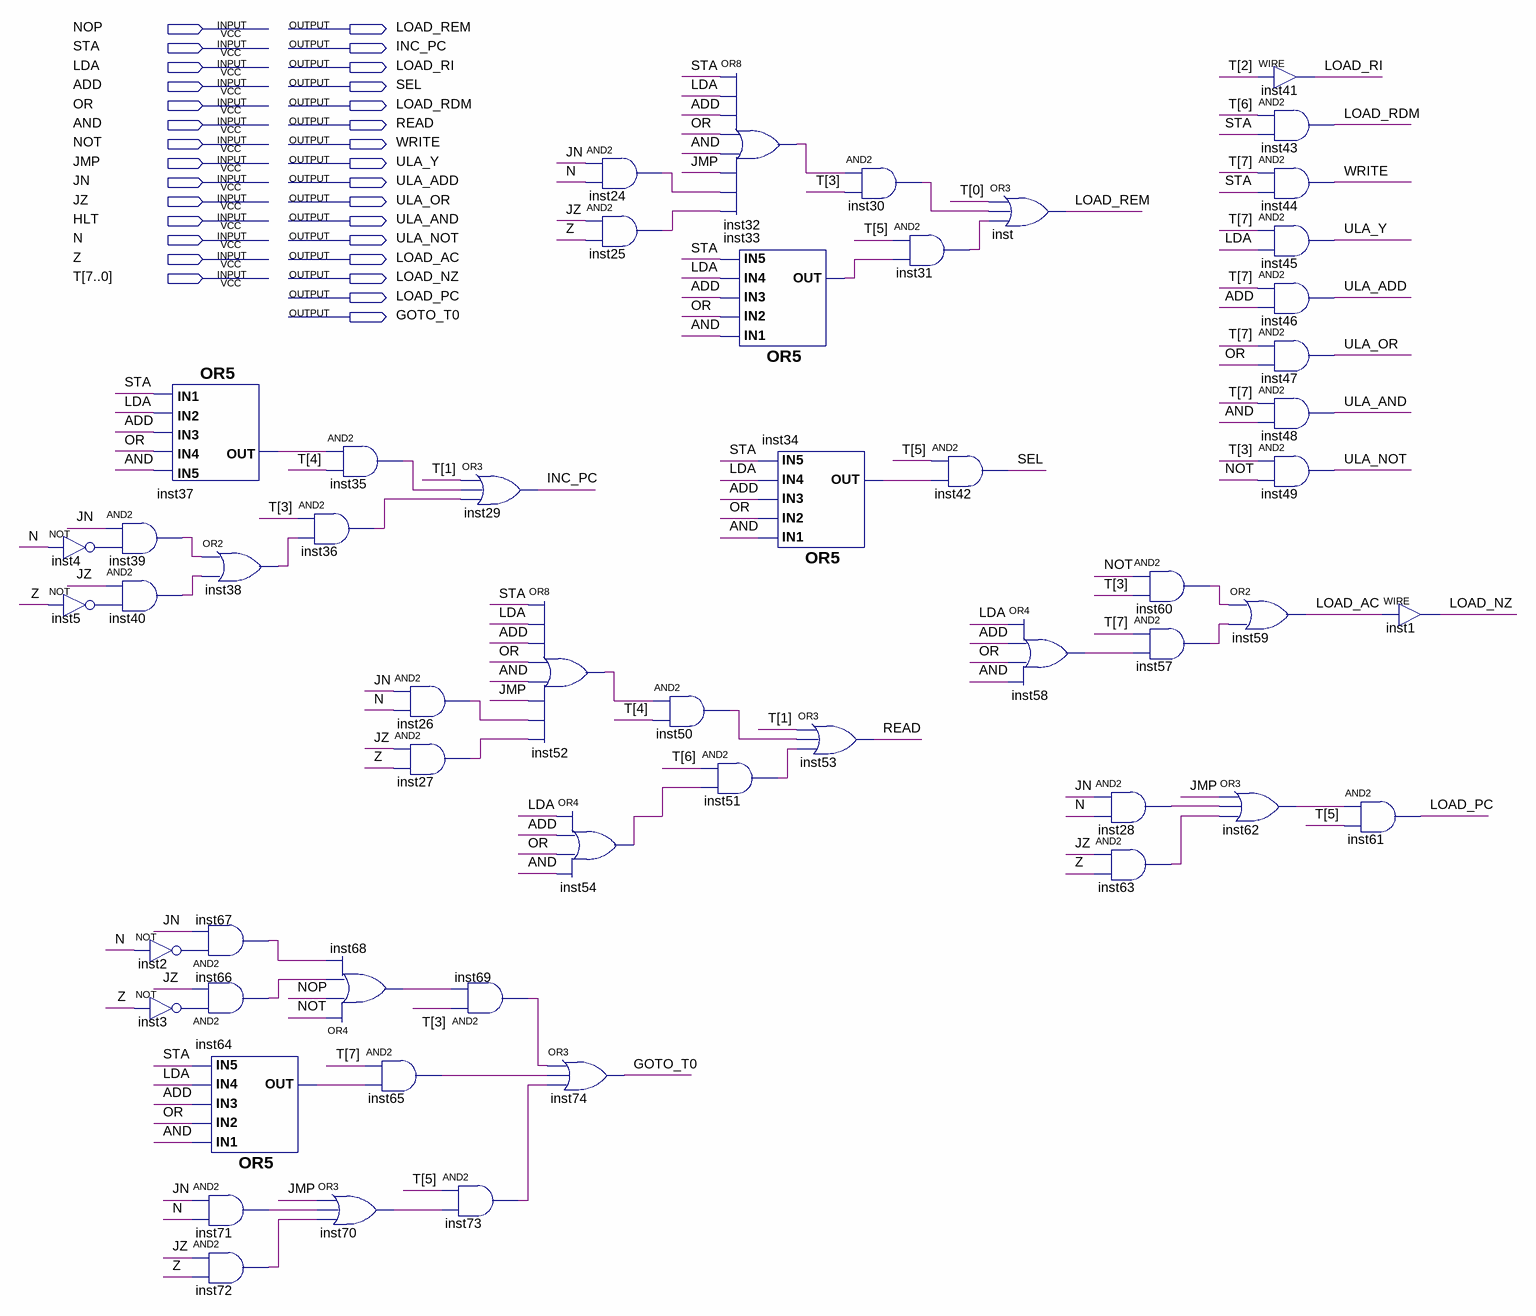
[diagram p0: schematic sheet]
// Quartus schematic CONTROL_UNIT.bdf as structural Verilog: 55 symbols, 30 pins
module CONTROL_UNIT (
  input  NOP,
  input  STA,
  input  LDA,
  input  ADD,
  input  OR,
  input  AND,
  input  NOT,
  input  JMP,
  input  JN,
  input  JZ,
  input  HLT,
  input  N,
  input  Z,
  input  [7:0] T,
  output LOAD_REM,
  output INC_PC,
  output LOAD_RI,
  output SEL,
  output LOAD_RDM,
  output READ,
  output WRITE,
  output ULA_Y,
  output ULA_ADD,
  output ULA_OR,
  output ULA_AND,
  output ULA_NOT,
  output LOAD_AC,
  output LOAD_NZ,
  output LOAD_PC,
  output GOTO_T0
);

  wire inst2_out, inst3_out, inst4_out, inst5_out, inst24_out, inst25_out, inst26_out, inst27_out,
       inst28_out, inst30_out, inst31_out, inst32_out, inst33_out, inst34_out, inst35_out, inst36_out,
       inst37_out, inst38_out, inst39_out, inst40_out, inst50_out, inst51_out, inst52_out, inst54_out,
       inst57_out, inst58_out, inst60_out, inst62_out, inst63_out, inst64_out, inst65_out, inst66_out,
       inst67_out, inst68_out, inst69_out, inst70_out, inst71_out, inst72_out, inst73_out;

  not inst4 (inst4_out, N);
  not inst5 (inst5_out, Z);
  or inst37 (inst37_out, STA, LDA, ADD, OR, AND);
  and inst39 (inst39_out, JN, inst4_out);
  and inst40 (inst40_out, JZ, inst5_out);
  not inst2 (inst2_out, N);
  not inst3 (inst3_out, Z);
  or inst38 (inst38_out, inst39_out, inst40_out);
  and inst67 (inst67_out, inst2_out, JN);
  and inst66 (inst66_out, inst3_out, JZ);
  or inst64 (inst64_out, AND, OR, ADD, LDA, STA);
  and inst71 (inst71_out, JN, N);
  and inst72 (inst72_out, JZ, Z);
  and inst35 (inst35_out, inst37_out, T[4]);
  and inst36 (inst36_out, T[3], inst38_out);
  or inst68 (inst68_out, NOT, NOP, inst66_out, inst67_out);
  or inst70 (inst70_out, JMP, inst71_out, inst72_out);
  and inst26 (inst26_out, JN, N);
  and inst27 (inst27_out, JZ, Z);
  and inst65 (inst65_out, T[7], inst64_out);
  or inst29 (INC_PC, T[1], inst35_out, inst36_out);
  and inst69 (inst69_out, T[3], inst68_out);
  and inst73 (inst73_out, T[5], inst70_out);
  or inst52 (inst52_out, STA, LDA, ADD, OR, AND, JMP, inst26_out, inst27_out);
  or inst54 (inst54_out, LDA, ADD, OR, AND);
  or inst74 (GOTO_T0, inst69_out, inst65_out, inst73_out);
  and inst24 (inst24_out, JN, N);
  and inst25 (inst25_out, JZ, Z);
  and inst50 (inst50_out, inst52_out, T[4]);
  and inst51 (inst51_out, T[6], inst54_out);
  or inst32 (inst32_out, STA, LDA, ADD, OR, AND, JMP, inst24_out, inst25_out);
  or inst33 (inst33_out, AND, OR, ADD, LDA, STA);
  or inst34 (inst34_out, AND, OR, ADD, LDA, STA);
  and inst30 (inst30_out, inst32_out, T[3]);
  or inst53 (READ, T[1], inst50_out, inst51_out);
  and inst31 (inst31_out, T[5], inst33_out);
  and inst42 (SEL, T[5], inst34_out);
  or inst (LOAD_REM, T[0], inst30_out, inst31_out);
  or inst58 (inst58_out, LDA, ADD, OR, AND);
  and inst28 (inst28_out, JN, N);
  and inst63 (inst63_out, JZ, Z);
  and inst60 (inst60_out, NOT, T[3]);
  and inst57 (inst57_out, T[7], inst58_out);
  or inst59 (LOAD_AC, inst60_out, inst57_out);
  or inst62 (inst62_out, JMP, inst28_out, inst63_out);
  assign LOAD_RI = T[2];  // WIRE inst41
  and inst43 (LOAD_RDM, T[6], STA);
  and inst44 (WRITE, T[7], STA);
  and inst45 (ULA_Y, T[7], LDA);
  and inst46 (ULA_ADD, T[7], ADD);
  and inst47 (ULA_OR, T[7], OR);
  and inst48 (ULA_AND, T[7], AND);
  and inst49 (ULA_NOT, T[3], NOT);
  assign LOAD_NZ = LOAD_AC;  // WIRE inst1
  and inst61 (LOAD_PC, inst62_out, T[5]);
endmodule
